# Altium schematic sheet Schematic_car_like_pcb.SchDoc
size A4; SheetNumber: 1; SheetTotal: 1
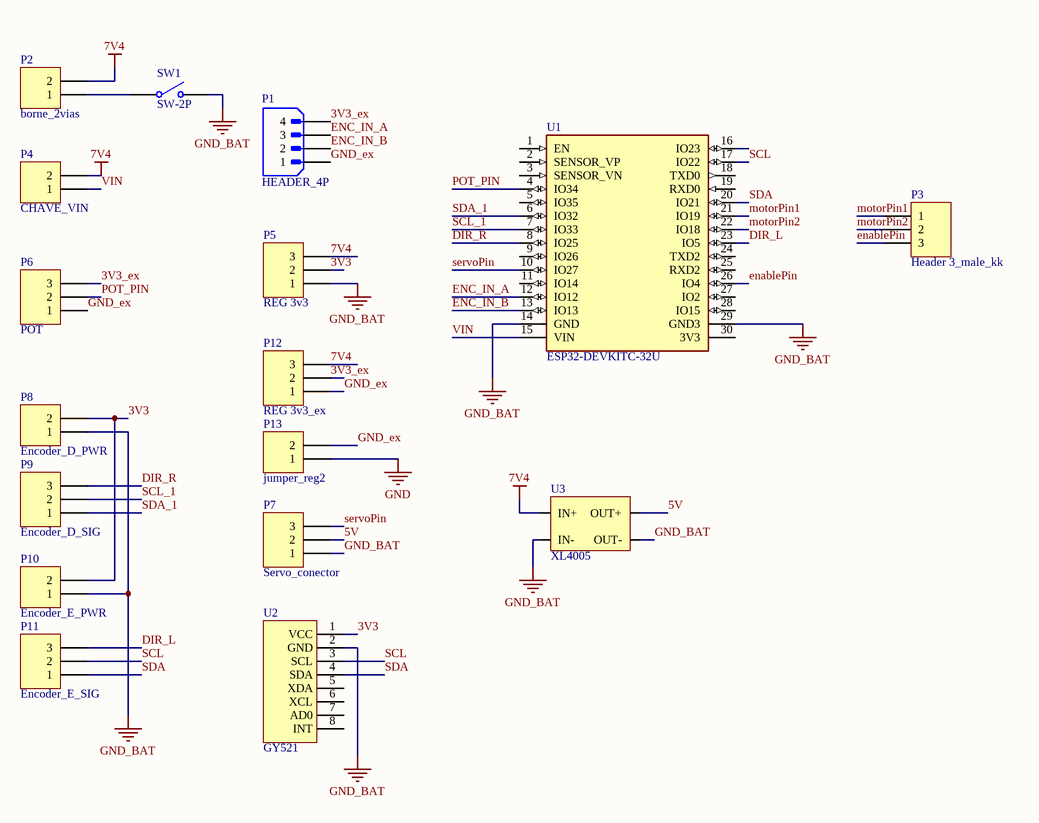
[diagram p0: Schematic_car_like_pcb.SchDoc]

## Parts
P1  HEADER_4P  [HEADER_4PIN]
P2  borne_2vias  [BORNE_2VIAS]
P3  Header 3_male_kk  [HDR1X3_M - KK]
P4  CHAVE_VIN  [HDR1X2_M - KK]
P5  REG 3v3  [HDR1X3_F]
P6  POT  [HDR1X3_M - KK]
P7  Servo_conector  [HDR1X3_M - KK]
P8  Encoder_D_PWR  [HDR1X2_M - KK]
P9  Encoder_D_SIG  [HDR1X3_M - KK]
P10  Encoder_E_PWR  [HDR1X2_M - KK]
P11  Encoder_E_SIG  [HDR1X3_M - KK]
P12  REG 3v3_ex  [HDR1X3_F]
P13  jumper_reg2  [HDR1X2_M - KK]
SW1  SW-2P  [SW-2]
U1  ESP32-DEVKITC-32U  [ESP32S]
U2  GY521  [GY521]
U3  XL4005  [XL4005]

## Nets
7V4: P2.2 P4.2 P5.3 P12.3 U3.2(IN+)
GND: P13.1
GND_BAT: P5.1 P7.1 P8.1 P10.1 SW1.2(NO) U1.14(GND) U1.29(GND3) U2.2(GND) U3.1(IN-) U3.3(OUT-)
3V3: P5.2 P8.2 P10.2 U2.1(VCC)
3V3_ex: P1.4 P6.3 P12.2
5V: P7.2 U3.4(OUT+)
DIR_L: P11.3 U1.23(IO5)
DIR_R: P9.3 U1.8(IO25)
enablePin: P3.3 U1.26(IO4)
ENC_IN_A: P1.3 U1.12(IO12)
ENC_IN_B: P1.2 U1.13(IO13)
GND_ex: P1.1 P6.1 P12.1 P13.2
motorPin1: P3.1 U1.21(IO19)
motorPin2: P3.2 U1.22(IO18)
POT_PIN: P6.2 U1.4(IO34)
SCL: P11.2 U1.17(IO22) U2.3(SCL)
SCL_1: P9.2 U1.7(IO33)
SDA: P11.1 U1.20(IO21) U2.4(SDA)
SDA_1: P9.1 U1.6(IO32)
servoPin: P7.3 U1.10(IO27)
VIN: P4.1 U1.15(VIN)
NetP2_1: P2.1 SW1.1(COMMON)

Not connected (* = marked no-connect by the designer): U1 1(EN) 2(SENSOR_VP) 3(SENSOR_VN) 5(IO35) 9(IO26) 11(IO14) 16(IO23) 18(TXD0) 19(RXD0) 24(TXD2) 25(RXD2) 27(IO2) 28(IO15) 30(3V3); U2 5(XDA) 6(XCL) 7(AD0) 8(INT)

## Library data of the parts
P3 P6 P7 P9 P11 = Header 3_male_kk: Header, 3-Pin; LatestRevisionDate: 17-Jul-2002; LatestRevisionNote: Re-released for DXP Platform.; Publisher: Altium Limited
P4 P8 P10 P13 = Header 2_male_kk: Header, 2-Pin; LatestRevisionDate: 17-Jul-2002; LatestRevisionNote: Re-released for DXP Platform.; Publisher: Altium Limited
P5 P12 = Header 3_female: Header, 3-Pin; LatestRevisionDate: 17-Jul-2002; LatestRevisionNote: Re-released for DXP Platform.; Publisher: Altium Limited
U1 = ESP32-DEVKITC-32U: ESP32-WROOM-32UE series Transceiver; 802.11 b/g/n (Wi-Fi, WiFi, WLAN), BluetoothÂ® Smart Ready 4.x Dual Mode Evaluation Board; MF: Espressif Systems; SnapEDA_Link: https://www.snapeda.com/parts/ESP32-DEVKITC-32U/Espressif+Systems/view-part/?ref=snap; Availability: In Stock; Purchase-URL: https://pricing.snapeda.com/search/part/ESP32-DEVKITC-32U/?ref=eda; Check_prices: https://www.snapeda.com/parts/ESP32-DEVKITC-32U/Espressif+Systems/view-part/?ref=eda; Value: *; Package: None; MP: ESP32-DEVKITC-32U; Price: None